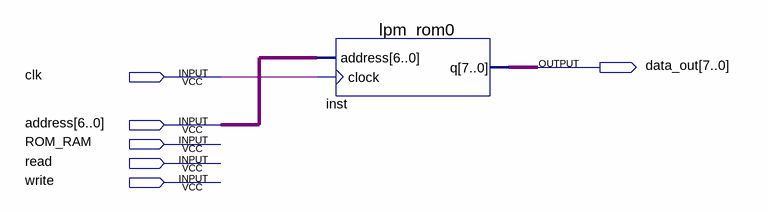
[diagram p0: schematic sheet]
// Quartus schematic lab3.bdf as structural Verilog: 1 symbols, 6 pins
module lab3 (
  input  clk,
  input  [6:0] address,
  input  ROM_RAM,
  input  read,
  input  write,
  output [7:0] data_out
);

  lpm_rom0 inst (.address(address), .clock(clk), .q(data_out));
endmodule
